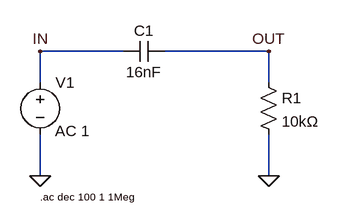
[diagram p0: schematic schematic.asc]
schematic.asc, the LTspice schematic file:
Version 4.1
SHEET 1 880 680
WIRE 144 64 16 64
WIRE 368 64 208 64
WIRE 16 112 16 64
WIRE 368 112 368 64
WIRE 16 256 16 192
WIRE 368 256 368 192
FLAG 368 256 0
FLAG 16 256 0
FLAG 16 64 IN
FLAG 368 64 OUT
SYMBOL voltage 16 96 R0
WINDOW 123 23 91 Left 2
WINDOW 39 0 0 Left 0
SYMATTR Value2 AC 1
SYMATTR InstName V1
SYMATTR Value ""
SYMBOL cap 208 48 R90
WINDOW 0 0 32 VBottom 2
WINDOW 3 32 32 VTop 2
SYMATTR InstName C1
SYMATTR Value 16nF
SYMBOL res 352 96 R0
SYMATTR InstName R1
SYMATTR Value 10kΩ
TEXT 16 288 Left 1 !.ac dec 100 1 1Meg

The netlist it stands for:
* schematic.asc
V1 IN 0 AC 1
C1 OUT IN 16nF
R1 OUT 0 10kΩ
.ac dec 100 1 1Meg
.backanno
.end